# EAGLE design shoulder (EAGLE 7.6.0)
VERSION: 3
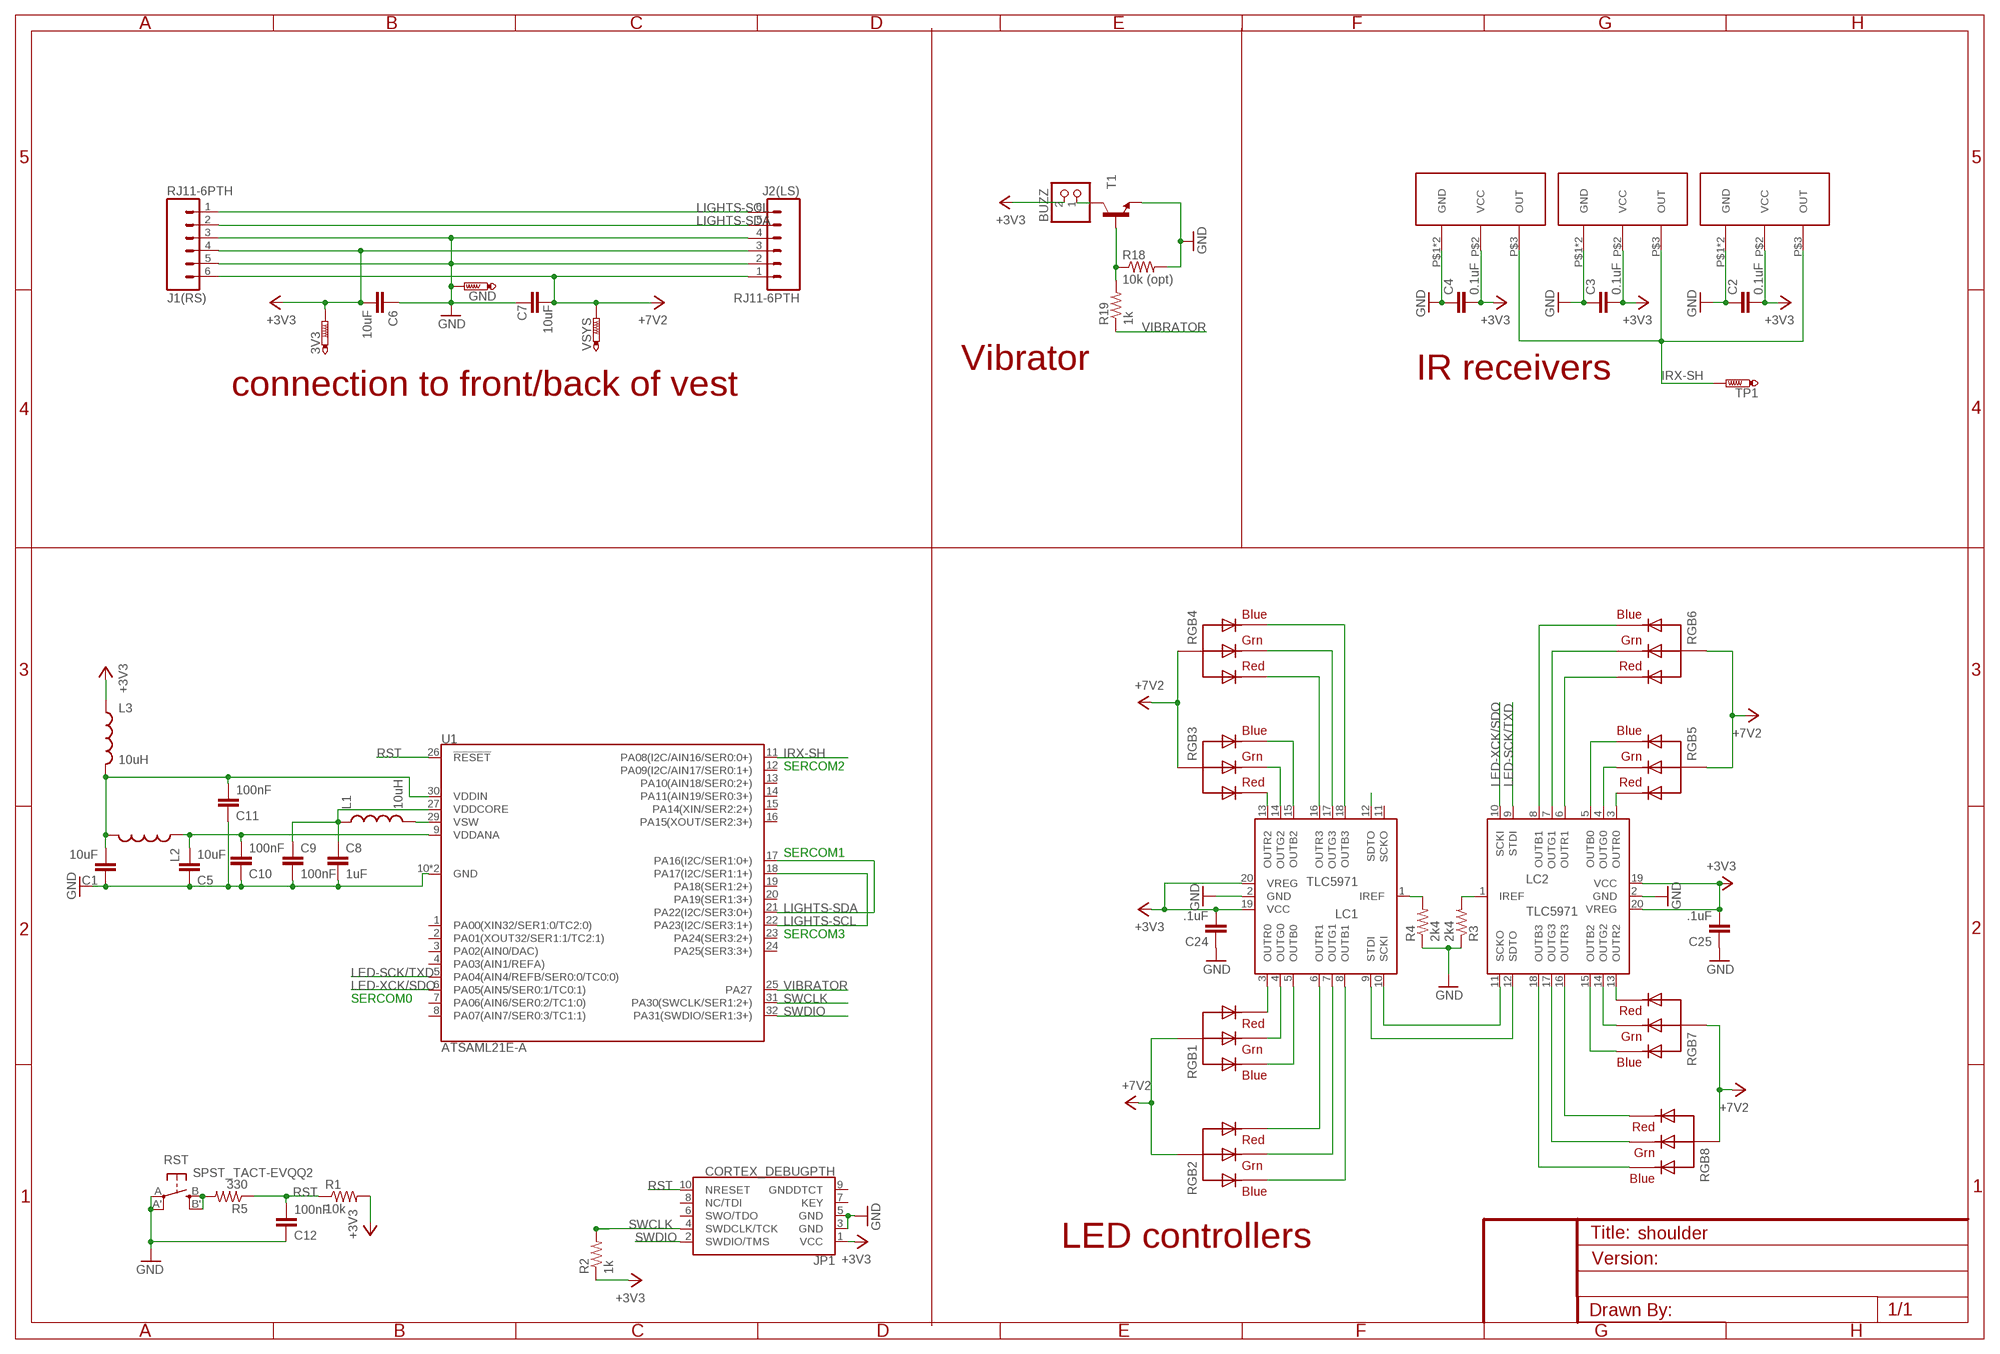
[diagram p0: schematic, sheet 1]

## Parts
3V3  PTR1PAD1-17  [P1-17]
BUZZ  JST_2PIN-THM  [JST-PH-2-THM]
C1  10uF  CAP0603-CAP  [0603-CAP]
C2  0.1uF  CAP0603-CAP  [0603-CAP]
C3  0.1uF  CAP0603-CAP  [0603-CAP]
C4  0.1uF  CAP0603-CAP  [0603-CAP]
C5  10uF  CAP0603-CAP  [0603-CAP]
C6  10uF  CAP1206  [1206]
C7  10uF  CAP1206  [1206]
C8  1uF  CAP0603-CAP  [0603-CAP]
C9  100nF  CAP0603-CAP  [0603-CAP]
C10  100nF  CAP0603-CAP  [0603-CAP]
C11  100nF  CAP0603-CAP  [0603-CAP]
C12  100nF  CAP0603-CAP  [0603-CAP]
C24  .1uF  CAP0603-CAP  [0603-CAP]
C25  .1uF  CAP0603-CAP  [0603-CAP]
GND  PTR1PAD1-17  [P1-17]
J1(RS)  RJ11-6PTH  [RJ11-6]
J2(LS)  RJ11-6PTH  [RJ11-6]
JP1  CORTEX_DEBUGPTH  [2X5-PTH-1.27MM]
L1  10uH  INDUCTOR0805  [0805]
L2  INDUCTOR0603  [0603]
L3  10uH  INDUCTOR0805  [0805]
LC1  TLC5971  [SSOP20]
LC2  TLC5971  [SSOP20]
R1  10k  RESISTOR0603-RES  [0603-RES]
R2  1k  RESISTOR0603-RES  [0603-RES]
R3  2k4  RESISTOR0603-RES  [0603-RES]
R4  2k4  RESISTOR0603-RES  [0603-RES]
R5  330  RESISTOR0603-RES  [0603-RES]
R18  10k (opt)  RESISTOR0603-RES  [0603-RES]
R19  1k  RESISTOR0603-RES  [0603-RES]
RGB1  AVAGO-RGB-SMT  [AVAGO-SMT-RGB]
RGB2  AVAGO-RGB-SMT  [AVAGO-SMT-RGB]
RGB3  AVAGO-RGB-SMT  [AVAGO-SMT-RGB]
RGB4  AVAGO-RGB-SMT  [AVAGO-SMT-RGB]
RGB5  AVAGO-RGB-SMT  [AVAGO-SMT-RGB]
RGB6  AVAGO-RGB-SMT  [AVAGO-SMT-RGB]
RGB7  AVAGO-RGB-SMT  [AVAGO-SMT-RGB]
RGB8  AVAGO-RGB-SMT  [AVAGO-SMT-RGB]
RST  SPST_TACT-EVQQ2  [EVQ-Q2]
T1  TRANSISTOR_NPNSOT23  [SOT23]
TP1  PTR1PAD1-17  [P1-17]
U1  ATSAML21E-A  [TQFP-32-7X7-0.8MM]
U$1  TSMP77000SIDE  [TSMP77000]
U$2  TSMP77000SIDE  [TSMP77000]
U$3  TSMP77000UP  [HEIMDALL-UP]
VSYS  PTR1PAD1-17  [P1-17]

## Nets
+3V3: 3V3.TP BUZZ.2 C2.2 C3.2 C4.2 C6.2 C24.2 C25.2 J1(RS).4 J2(LS).3 JP1.1(VCC) L3.1 LC1.19(VCC) LC1.20(VREG) LC2.19(VCC) LC2.20(VREG) R1.2 R2.1 U$1.P$2(VCC) U$2.P$2(VCC) U$3.P$2(VCC)
+7V2: C7.2 J1(RS).6 J2(LS).1 RGB1.P$4(VCC) RGB1.P$5(VCC) RGB1.P$6(VCC) RGB2.P$4(VCC) RGB2.P$5(VCC) RGB2.P$6(VCC) RGB3.P$4(VCC) RGB3.P$5(VCC) RGB3.P$6(VCC) RGB4.P$4(VCC) RGB4.P$5(VCC) RGB4.P$6(VCC) RGB5.P$4(VCC) RGB5.P$5(VCC) RGB5.P$6(VCC) RGB6.P$4(VCC) RGB6.P$5(VCC) RGB6.P$6(VCC) RGB7.P$4(VCC) RGB7.P$5(VCC) RGB7.P$6(VCC) RGB8.P$4(VCC) RGB8.P$5(VCC) RGB8.P$6(VCC) VSYS.TP
GND: C1.1 C2.1 C3.1 C4.1 C5.1 C6.1 C7.1 C8.2 C9.2 C10.1 C11.1 C12.1 C24.1 C25.1 GND.TP J1(RS).3 J1(RS).5 J2(LS).2 J2(LS).4 JP1.3(GND) JP1.5(GND) LC1.2(GND) LC2.2(GND) R3.1 R4.1 R18.2 RST.A'(P1) RST.A(P) T1.2(E) U1.10(GND) U1.28(GND) U$1.P$1(GND) U$1.P$4(GND) U$2.P$1(GND) U$2.P$4(GND) U$3.P$1(GND) U$3.P$4(GND)
IRX-SH: TP1.TP U1.11(PA08(I2C/AIN16/SER0:0+)) U$1.P$3(OUT) U$2.P$3(OUT) U$3.P$3(OUT)
LED-SCK/TXD: LC2.9(STDI) U1.5(PA04(AIN4/REFB/SER0:0/TC0:0))
LED-XCK/SDO: LC2.10(SCKI) U1.6(PA05(AIN5/SER0:1/TC0:1))
LIGHTS-SCL: J1(RS).1 J2(LS).6 U1.18(PA17(I2C/SER1:1+)) U1.22(PA23(I2C/SER3:1+))
LIGHTS-SDA: J1(RS).2 J2(LS).5 U1.17(PA16(I2C/SER1:0+)) U1.21(PA22(I2C/SER3:0+))
N$1: LC1.10(SCKI) LC2.11(SCKO)
N$2: LC1.9(STDI) LC2.12(SDTO)
N$3: LC1.12(SDTO)
N$4: C5.2 C10.2 L2.1 U1.9(VDDANA)
N$5: C1.2 C11.2 L2.2 L3.2 U1.30(VDDIN)
N$6: R5.2 RST.B'(S1) RST.B(S)
N$7: L1.2 U1.29(VSW)
N$8: LC1.3(OUTR0) RGB1.P$3(RED)
N$10: LC2.3(OUTR0) RGB5.P$3(RED)
N$11: LC2.6(OUTR1) RGB6.P$3(RED)
N$12: C8.1 C9.1 L1.1 U1.27(VDDCORE)
N$14: BUZZ.1 T1.3(C)
N$17: LC1.15(OUTB2) RGB3.P$1(BLUE)
N$19: R18.1 R19.2 T1.1(B)
N$24: LC1.13(OUTR2) RGB3.P$3(RED)
N$27: LC1.14(OUTG2) RGB3.P$2(GREEN)
N$31: LC1.16(OUTR3) RGB4.P$3(RED)
N$32: LC1.17(OUTG3) RGB4.P$2(GREEN)
N$33: LC1.18(OUTB3) RGB4.P$1(BLUE)
N$36: LC1.4(OUTG0) RGB1.P$2(GREEN)
N$37: LC1.5(OUTB0) RGB1.P$1(BLUE)
N$38: LC1.6(OUTR1) RGB2.P$3(RED)
N$39: LC1.7(OUTG1) RGB2.P$2(GREEN)
N$40: LC1.8(OUTB1) RGB2.P$1(BLUE)
N$42: LC2.4(OUTG0) RGB5.P$2(GREEN)
N$43: LC2.5(OUTB0) RGB5.P$1(BLUE)
N$49: LC2.7(OUTG1) RGB6.P$2(GREEN)
N$50: LC2.8(OUTB1) RGB6.P$1(BLUE)
N$51: LC2.16(OUTR3) RGB8.P$3(RED)
N$52: LC2.17(OUTG3) RGB8.P$2(GREEN)
N$53: LC2.18(OUTB3) RGB8.P$1(BLUE)
N$54: LC2.15(OUTB2) RGB7.P$1(BLUE)
N$55: LC2.14(OUTG2) RGB7.P$2(GREEN)
N$56: LC2.13(OUTR2) RGB7.P$3(RED)
N$61: LC1.1(IREF) R4.2
N$62: LC2.1(IREF) R3.2
RST: C12.2 JP1.10(NRESET) R1.1 R5.1 U1.26(!RESET!)
SWCLK: JP1.4(SWDCLK/TCK) R2.2 U1.31(PA30(SWCLK/SER1:2+))
SWDIO: JP1.2(SWDIO/TMS) U1.32(PA31(SWDIO/SER1:3+))
VIBRATOR: R19.1 U1.25(PA27)
Unconnected: JP1.6(SWO/TDO) JP1.7(KEY) JP1.8(NC/TDI) JP1.9(GNDDTCT) LC1.11(SCKO) U1.1(PA00(XIN32/SER1:0/TC2:0)) U1.2(PA01(XOUT32/SER1:1/TC2:1)) U1.3(PA02(AIN0/DAC)) U1.4(PA03(AIN1/REFA)) U1.7(PA06(AIN6/SER0:2/TC1:0)) U1.8(PA07(AIN7/SER0:3/TC1:1)) U1.12(PA09(I2C/AIN17/SER0:1+)) U1.13(PA10(AIN18/SER0:2+)) U1.14(PA11(AIN19/SER0:3+)) U1.15(PA14(XIN/SER2:2+)) U1.16(PA15(XOUT/SER2:3+)) U1.19(PA18(SER1:2+)) U1.20(PA19(SER1:3+)) U1.23(PA24(SER3:2+)) U1.24(PA25(SER3:3+))

## Notes on the sheet
- Vibrator | IR receivers
- connection to front/back of vest
- SERCOM2
- SERCOM1
- SERCOM3
- SERCOM0
- LED controllers

## Library data of the parts
3V3 GND TP1 VSYS = testpad:PTR1: TEST PIN
BUZZ = adafruit:JST_2PIN: JST 2-Pin Connectors of various flavors SMT-RA (S2B-PH-SM4) 4UConnector #17311 SMT (B2B-PH-SM4) THM-RA (S2B-PH) THM (B2B-PH)
C1 C5-C12 = SparkFun-Passives:CAP: Capacitor Standard 0603 ceramic capacitor, and 0.1" leaded capacitor.
C2-C4 C24 C25 = SparkFun-Capacitors:CAP: Capacitor Standard 0603 ceramic capacitor, and 0.1" leaded capacitor.
J1(RS) J2(LS) = SparkFun-Connectors:RJ11-6: RJ11 Jack Simple 6 pin RJ11 jack. Commonly found on CAT3 devices and Microchip programmers. SKU: PRT-00132
JP1 = greg:CORTEX_DEBUG: Cortex Debug Connector Datasheet <http://infocenter.arm.com/help/topic/com.arm.doc.faqs/attached/13634/cortex_debug_connectors.pdf>
L1-L3 = SparkFun-Passives:INDUCTOR: Inductors Basic Inductor/Choke - 0603 and 1206. Footprints are not proven and vary greatly between part numbers. INDUCTOR POWER 3.3UH 4.0A SMD 0.197" L x 0.197" W x 0.177" H (5.00mm x 5.00mm x 4.50mm)
LC1 LC2 = greg:TLC5971
R1-R5 R18 R19 = SparkFun-Resistors:RESISTOR: Resistor Basic schematic elements and footprints for 0603, 1206, and PTH resistors.
RGB1-RGB8 = greg:AVAGO-RGB-SMT
RST = adafruit:SPST_TACT: SMT 6mm switch, EVQQ2 series http://www.ladyada.net/library/eagle
T1 = SparkFun-DiscreteSemi:TRANSISTOR_NPN: Generic NPN BJT. MMBT2222 is the common NPN we use. Double check against datasheet- not all devices are the same!
U1 = greg:ATSAML21E: Atmel SAML21E SMART ARM-Based Microcontroller The Atmel ® | SMART ™ SAM L21 is a series of low-power microcontrollers using the 32-bit ARM ® Cortex ® -M0+ processor, and ranging from 32- to 64-pins with up to 256KB Flash and 32KB of SRAM. The SAM L21 devices operate at a maximum frequency of 48MHz and reach 2.46 CoreMark/MHz. They are designed for simple and intuitive migration with identical peripheral modules, hex compatible code, identical linear address map and pin compatible migration paths between all devices in the product series. All devices include intelligent and flexible peripherals, Atmel Event System for inter-peripheral signaling, and support for capacitive touch button, slider and wheel user interfaces.
U$1-U$3 = greg:TSMP77000

## Board
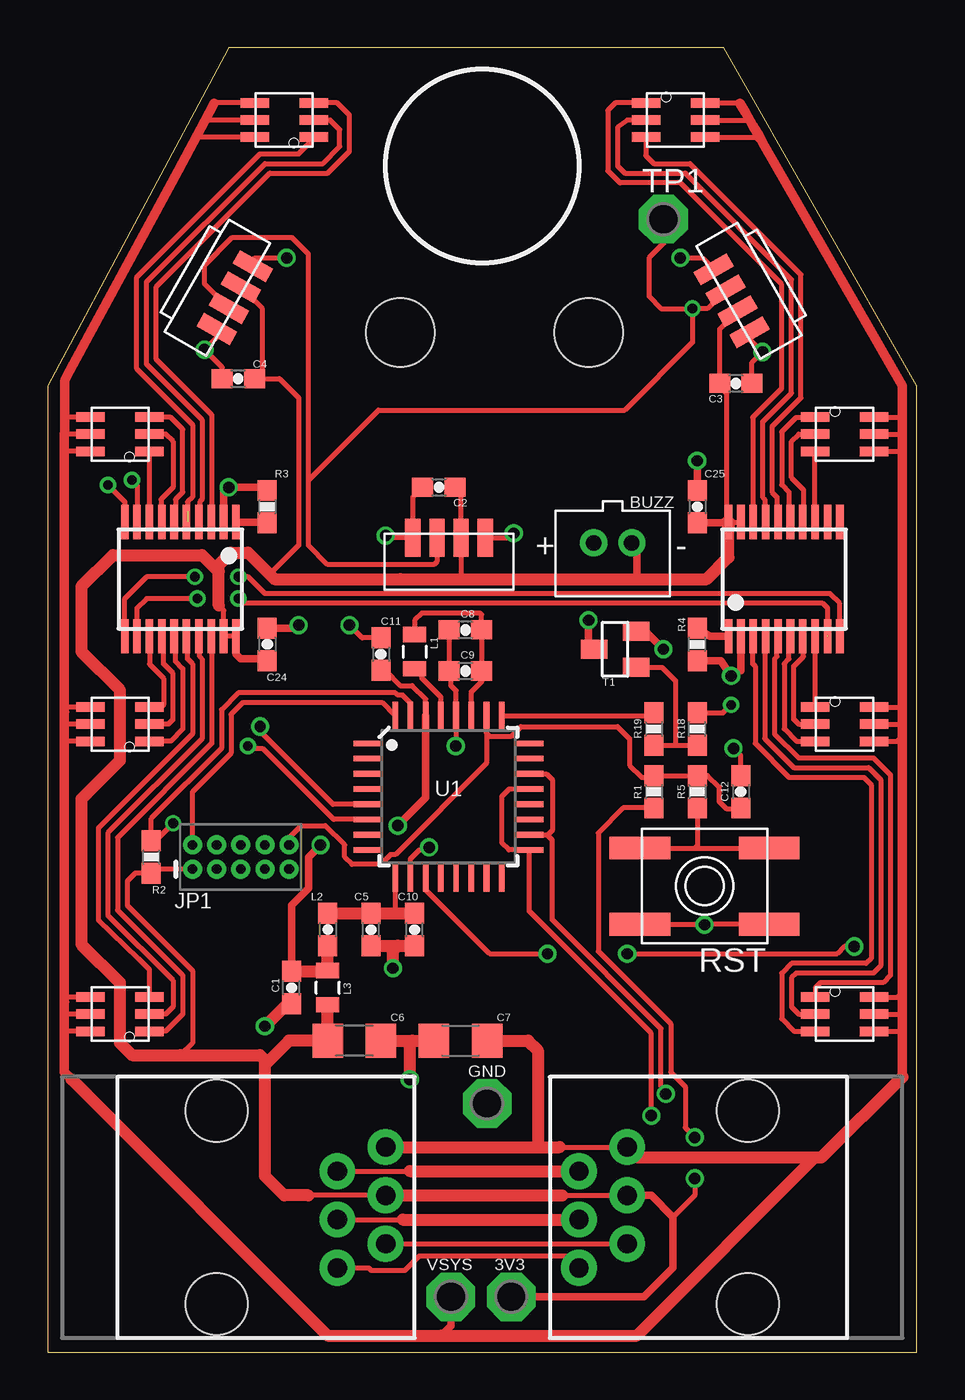
[diagram p1: board, top side]
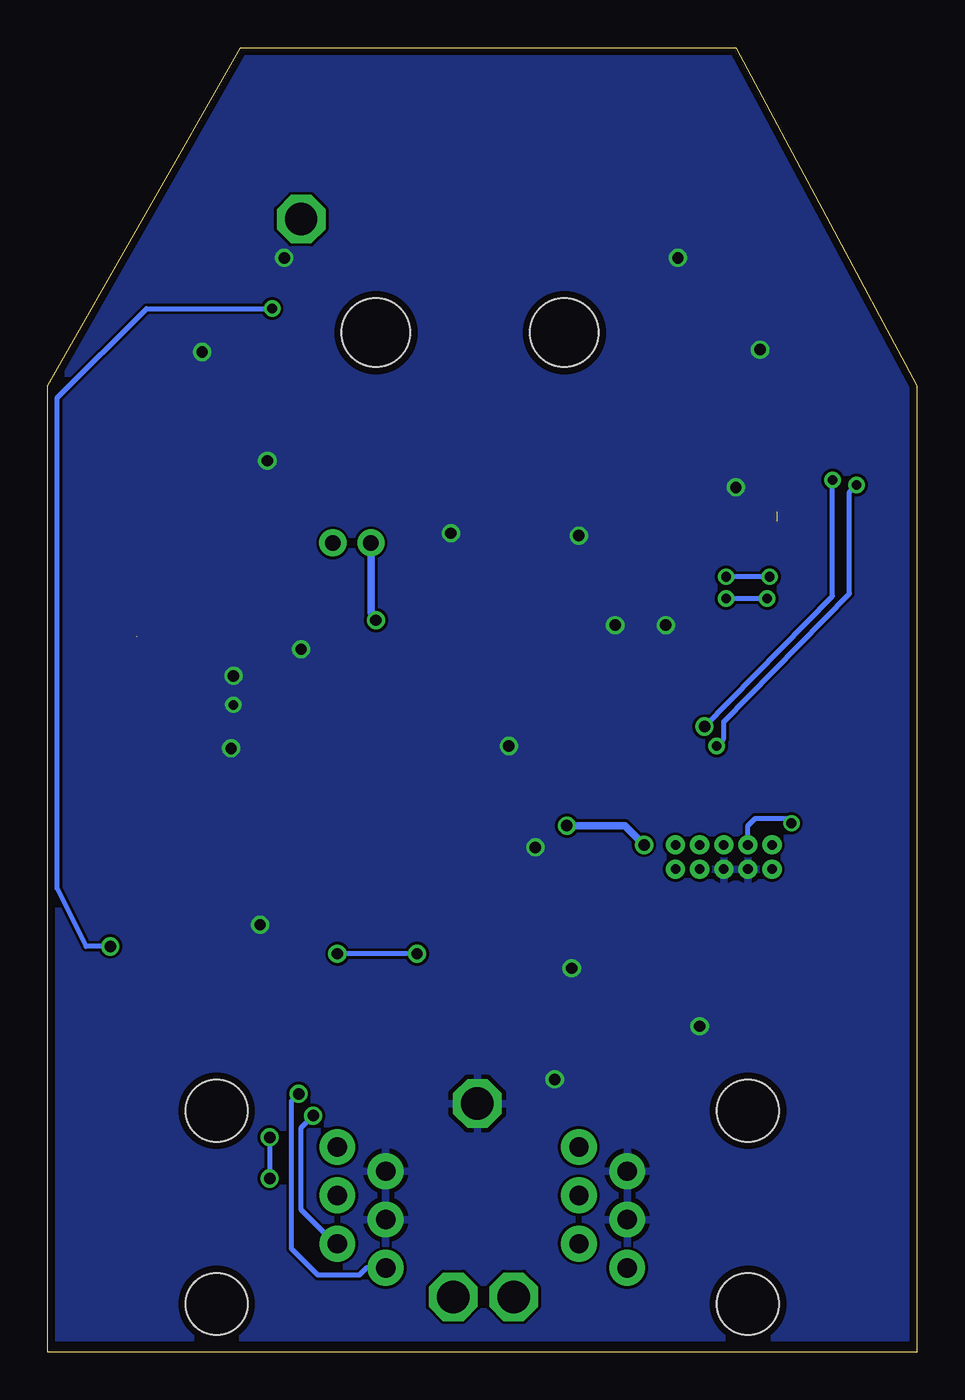
[diagram p2: board, bottom side, seen from below]

Size 45.72 x 68.58 mm. Coordinates in mm from the lower left corner, seen from the top.
Outline: 0,0 45.72,0 45.72,50.8 35.56,68.58 9.53,68.58 0,50.8 0,0
Copper layers (1*16): Top 0.0356mm / dielectric 1.5011mm / Bottom 0.0356mm
Design rules "default": minimum track width 6mil, minimum drill 13mil, track to track 6mil, track to pad 6mil, pad to pad 6mil, via to via 6mil, smd to smd 6mil, copper to edge 15mil, drill to drill 6mil, minimum pad ring 7mil, minimum via ring 7mil, stop-mask expansion 4mil, vias tented up to drill 0mil, thermal gap 10mil
Holes 3.61 mm at 18.54,53.59 28.45,53.59

### Footprints (pad centres in the part's own frame; a part is rotated, then mirrored left to right if it is on the bottom)
P1-17 = drill 1.702 pad 2.54 octagon: TP 0,0
JST-PH-2-THM = drill 0.8 pad 1.422: 1 1,0; 2 -1,0
0603-CAP = smd 1.1 x 1: 1 -0.85,0; 2 0.85,0
1206 = smd 1.6 x 1.8: 1 -1.4,0; 2 1.4,0
RJ11-6 = drill 1.016 pad 1.88: 1 1.905,8.89; 2 3.175,6.35; 3 4.445,8.89; 4 5.715,6.35; 5 6.985,8.89; 6 8.255,6.35 | hole 3.251: 0,0; 10.16,0
2X5-PTH-1.27MM = drill 0.508 pad 1: 1 -2.54,-0.635; 2 -2.54,0.635; 3 -1.27,-0.635; 4 -1.27,0.635; 5 0,-0.635; 6 0,0.635; 7 1.27,-0.635; 8 1.27,0.635; 9 2.54,-0.635; 10 2.54,0.635
0805 = smd 0.8 x 1.2: 1 -0.9,0; 2 0.9,0
0603 = smd 1.1 x 1: 1 -0.85,0; 2 0.85,0
SSOP20 = smd 0.4 x 1.8: 1 -2.925,-3; 2 -2.275,-3; 3 -1.625,-3; 4 -0.975,-3; 5 -0.325,-3; 6 0.325,-3; 7 0.975,-3; 8 1.625,-3; 9 2.275,-3; 10 2.925,-3; 11 2.925,3; 12 2.275,3; 13 1.625,3; 14 0.975,3; 15 0.325,3; 16 -0.325,3; 17 -0.975,3; 18 -1.625,3; 19 -2.275,3; 20 -2.925,3
0603-RES = smd 1.1 x 1: 1 -0.85,0; 2 0.85,0
AVAGO-SMT-RGB = smd 0.5 x 1.5: P$1 -0.9,-1.55; P$2 0,-1.55; P$3 0.9,-1.55; P$4 -0.9,1.55; P$5 0,1.55; P$6 0.9,1.55
EVQ-Q2 = smd 3.2 x 1.2: A -3.4,-2; A' 3.4,-2; B -3.4,2; B' 3.4,2
SOT23 = smd 1 x 1.4: 1 -0.95,-1.1; 2 0.95,-1.1; 3 0,1.1
TQFP-32-7X7-0.8MM = smd 1.5 x 0.3: 1 -4.25,2.8; 2 -4.25,2; 3 -4.25,1.2; 5 -4.25,-0.4; 6 -4.25,-1.2; 7 -4.25,-2; 8 -4.25,-2.8; 17 4.25,-2.8; 18 4.25,-2; 19 4.25,-1.2; 20 4.25,-0.4; 22 4.25,1.2; 23 4.25,2; 24 4.25,2.8 | smd 1.5 x 0.28: 4 -4.25,0.4; 21 4.25,0.4 | smd 0.3 x 1.5: 9 -2.8,-4.25; 14 1.2,-4.25; 15 2,-4.25; 16 2.8,-4.25; 25 2.8,4.25; 26 2,4.25; 27 1.2,4.25; 28 0.4,4.25; 29 -0.4,4.25; 30 -1.2,4.25; 31 -2,4.25; 32 -2.8,4.25 | smd 0.28 x 1.5: 10 -2,-4.25; 11 -1.2,-4.25; 12 -0.4,-4.25; 13 0.4,-4.25
TSMP77000 = smd 0.8 x 2: P$1 2,1; P$2 0.73,1; P$3 -0.54,1; P$4 -1.81,1
HEIMDALL-UP = smd 0.8 x 2: P$1 -1.81,-0.27; P$2 -0.54,-0.27; P$3 0.73,-0.27; P$4 2,-0.27

### Placement (x,y rotation side)
3V3  24.38,2.92 0 top
BUZZ  29.72,42.55 180 top
C1  12.83,19.18 90 top
C2  20.57,45.47 0 top
C3  36.2,50.93 180 top
C4  10.03,51.18 0 top
C5  17.02,22.23 90 top
C6  16.13,16.38 180 top
C7  21.72,16.38 0 top
C8  21.97,37.97 180 top
C9  21.97,35.81 180 top
C10  19.3,22.23 90 top
C11  17.53,36.7 270 top
C12  36.45,29.46 270 top
C24  11.56,37.21 270 top
C25  34.16,44.45 270 top
GND  23.11,13.08 0 top
J1(RS)  36.83,2.54 90 top
J2(LS)  8.89,12.7 270 top
JP1  10.16,26.04 0 top
L1  19.3,36.83 270 top
L2  14.73,22.23 270 top
L3  14.73,19.18 90 top
LC1  38.73,40.64 0 top
LC2  6.99,40.64 180 top
R1  31.88,29.46 270 top
R2  5.46,26.04 90 top
R3  11.56,44.45 270 top
R4  34.16,37.21 90 top
R5  34.16,29.46 270 top
R18  34.16,32.77 90 top
R19  31.88,32.77 270 top
RGB1  41.91,17.78 270 top
RGB2  41.91,33.02 270 top
RGB3  41.91,48.26 270 top
RGB4  33.02,64.77 270 top
RGB5  12.45,64.77 90 top
RGB6  3.81,48.26 90 top
RGB7  3.81,33.02 90 top
RGB8  3.81,17.78 90 top
RST  34.54,24.51 0 top
T1  29.84,36.96 90 top
TP1  32.38,59.56 0 top
U1  21.08,29.21 0 top
U$1  10.67,54.86 60.3 top
U$2  35.05,54.86 299.7 top
U$3  21.21,42.55 180 top
VSYS  21.21,2.92 0 top

### Tracks (layer width: path | path; a pad name or v marks a point on that pad's centre or on a via)
+3V3  (via drill 0.6)
  Top 0.254: 27.05,8.26 J1(RS).4 | J2(LS).3 13.72,8.26 | LC2.20 LC2.19 9.26,39 9.01,39.25 | LC1.20 LC1.19 | U$1.P$2 11.3,54.85 11.3,51.56 10.92,51.18 C4.2 12.19,51.18 13.21,50.16 13.21,42.42 11.68,40.89 | U$2.P$2 35.34,53.79 C3.2 35.34,50.76 35.69,50.42 35.69,43.85 35.43,43.6 | 21.72,40.64 21.75,40.67 U$3.P$2 21.75,45.14 C2.2 | JP1.1 5.68,25.4 R2.1 4.61,25.18 4.19,24.77 4.19,23.5 7.62,20.07 7.62,16.26 6.99,15.62 | R1.2 30.27,28.61 28.96,27.3 28.96,21.08 32.77,17.27 32.77,14.73 33.53,13.97 33.53,11.81 v34.04,11.3 | v34.04,9.14 34.04,8.26 32.89,7.11
  Top 0.406: 18.53,40.66 18.54,40.64 | C24.2 11.21,36.45 10.16,36.45 9.91,36.7 LC2.20 | C25.2 35.43,43.6 36.02,43.6 LC1.20 | BUZZ.2 30.99,42.18 30.99,40.64 | 3V3.TP 31.37,2.92 32.89,4.45 32.89,7.11 31.75,8.26 J1(RS).4
  Top 0.635: J2(LS).3 27.05,8.26 | 13.72,8.26 12.45,8.26 11.43,9.27 11.43,15.11 | 11.43,15.11 11.43,15.37 11.18,15.62 6.99,15.62 4.45,15.62 3.81,16.26 3.81,19.43 1.78,21.46 1.78,29.08 3.81,31.11 3.81,34.8 1.78,36.83 1.78,40.26 3.43,41.91 8.13,41.91 9.01,41.03 | 9.01,39.25 9.01,41.03 | 9.01,41.03 9.01,41.39 9.65,42.04 10.54,42.04 11.68,40.89 11.94,40.64 18.54,40.64 21.72,40.64 30.99,40.64 34.67,40.64 35.81,41.78 35.81,43.39 LC1.20 | 11.43,15.11 12.7,16.38 C6.2 L3.1
  Bottom 0.254: v34.04,11.3 v34.04,9.14
+7V2
  Top 0.254: 1.02,33.66 0.89,33.53 | 1.02,18.41 0.89,18.54 | 44.83,18.41 44.96,18.29 | 26.92,10.79 J1(RS).6 | RGB7.P$4 2.25,32.13 0.89,32.13 | 2.16,33.02 RGB7.P$5 0.89,33.02 | RGB8.P$6 0.9,18.68 0.89,18.67 | RGB3.P$6 44.95,47.36 44.96,47.37 | RGB2.P$6 44.69,32.12 44.96,32.38 | RGB1.P$6 44.82,16.88 44.96,17.02 | 0.89,48.13 1.02,48.26 RGB6.P$5 | RGB3.P$4 44.95,49.16 44.96,49.15 | RGB3.P$5 44.96,48.26 | 37.38,63.87 37.42,63.91 | RGB8.P$5 0.89,17.78 | RGB8.P$4 1,16.88 0.89,16.76 | RGB1.P$4 44.72,18.68 44.96,18.92 | RGB1.P$5 44.83,17.78 44.96,17.65 | RGB2.P$4 44.82,33.92 44.96,33.78 | RGB2.P$5 44.83,33.02 44.96,32.89 | RGB7.P$6 2.25,33.91 0.89,33.91 | RGB5.P$5 8.19,64.77 8.26,64.71 | RGB5.P$6 8.65,65.67 8.76,65.66 | RGB5.P$4 7.83,63.87 7.86,63.97 | RGB4.P$6 37.26,63.87 37.7,63.43 | RGB4.P$5 36.8,64.77 37.09,64.48 | RGB4.P$4 36.29,65.67 36.56,65.4 | RGB6.P$6 0.91,49.16 0.9,49.15 | RGB6.P$4 1.03,47.36 0.89,47.5
  Top 0.406: VSYS.TP 21.21,1.4 20.7,0.89
  Top 0.508: 1.27,14.35 0.89,14.73 0.89,16.76 0.89,17.78 0.89,18.54 0.89,18.67 0.89,32.13 0.89,33.02 0.89,33.53 0.89,33.91 0.89,47.5 0.89,48.13 0.89,48.26 0.9,48.4 0.9,49.15 0.9,51.06 1.02,51.31 6.86,62.1 7.86,63.97 8.26,64.71 8.76,65.66 | 44.45,13.97 44.96,14.48 44.96,17.02 44.96,17.65 44.96,18.29 44.96,18.92 44.96,32.38 44.96,32.89 44.96,33.78 44.96,47.37 44.96,48.26 44.96,49.15 44.96,50.8 37.7,63.43 37.42,63.91 37.09,64.48 36.69,65.18 36.56,65.4 36.4,65.65
  Top 0.635: 1.27,14.35 14.73,0.89 20.7,0.89 30.99,0.89 40.35,10.25 | 44.96,14.48 40.68,10.25 40.35,10.25 | J2(LS).1 25.78,10.79 | 25.78,10.79 26.92,10.79 | J1(RS).6 31.02,10.25 40.35,10.25 | C7.2 25.27,16.38 25.78,15.88 25.78,10.79
GND  (via drill 0.5, 0.6)
  Top 0.254: J2(LS).2 19.05,9.53 | J2(LS).4 18.67,6.99 | U$1.P$1 10.47,57.1 10.9,57.53 v12.57,57.53 | C4.1 9.18,51.78 v8.26,52.7 8.9,53.35 U$1.P$4 | C3.1 37.05,52.03 v37.59,52.58 36.91,53.26 U$2.P$1 | v33.27,57.53 34.42,57.53 U$2.P$4 | C2.1 19.21,44.95 U$3.P$4 17.89,42.81 v17.78,42.93 | U$3.P$1 24.27,42.81 v24.51,43.05 | R18.2 35.52,33.62 v35.94,34.04 | RST.A 34.51,22.51 v34.54,22.48 34.58,22.51 RST.A' | C8.2 C9.2 21.21,35.73 21.21,35.05 21.48,34.78 U1.28 21.48,31.9 v21.46,31.88 | C12.1 36.45,31.37 v36.07,31.75 | C11.1 16.55,37.55 v15.88,38.23 | U1.10 19.08,25.94 19.56,26.42 19.94,26.42 v20.07,26.54
  Top 0.406: LC1.2 36.46,35.83 v35.94,35.56 35.39,36.36 R4.1 | C24.1 13.04,38.06 v13.21,38.23 | C25.1 v34.16,46.86 | LC2.2 9.26,45.2 v9.53,45.47 11.39,45.47 R3.1 | T1.2 31.43,37.91 v32.38,36.96
  Top 0.635: 19.05,9.53 J1(RS).5 | 18.67,6.99 J1(RS).3 | C6.1 19.18,16.38 | 19.18,16.38 C7.1 | v19.05,14.35 19.05,16.26 19.18,16.38 | C1.1 12.61,18.33 v11.43,17.14 | C5.1 18.41,21.38 | 18.41,21.38 C10.1 | v18.16,20.19 18.16,21.12 18.41,21.38
  pour Bottom: 0,50.8 9.02,68.58 35.69,68.58 45.72,50.8 45.97,0.76 0.25,0.76
IRX-SH  (via drill 0.51, 0.6)
  Top 0.254: U$1.P$3 8.26,56.17 8.26,57.15 9.72,58.61 12.83,58.61 13.72,57.72 13.72,45.85 | U$2.P$3 34.69,54.86 v33.91,54.86 | v33.91,54.86 33.91,53.09 30.35,49.53 17.4,49.53 13.72,45.85 | U$3.P$3 20.48,41.56 20.32,41.4 14.73,41.4 13.72,42.42 13.72,45.85 | TP1.TP 32.38,58.29 31.62,57.53 31.62,55.5 32.26,54.86 v33.91,54.86 | v42.42,21.34 41.91,21.34 41.53,20.95 v30.48,20.95 | U1.11 19.88,24.31 23.24,20.95 v26.29,20.95
  Bottom 0.254: v42.42,21.34 43.69,21.34 45.21,24.38 45.21,50.16 40.51,54.86 v33.91,54.86 | v26.29,20.95 v30.48,20.95
LED-SCK/TXD  (via drill 0.51, 0.6)
  Top 0.254: v4.45,45.85 4.71,45.58 LC2.9 | v11.18,32.89 11.18,32.64 15.01,28.81 U1.5
  Bottom 0.254: v11.18,32.89 4.45,39.75 v4.45,45.85
LED-XCK/SDO  (via drill 0.51)
  Top 0.254: v3.17,45.59 4.06,44.71 LC2.10 | v10.54,31.88 10.67,31.75 11.3,31.75 15.04,28.01 U1.6
  Bottom 0.254: v10.54,31.88 10.16,32.26 10.16,33.15 3.56,39.88 3.56,45.21 v3.17,45.59
LIGHTS-SCL  (via drill 0.6)
  Top 0.254: J2(LS).6 16.89,4.45 17.02,4.32 18.8,4.32 19.56,5.08 27.3,5.08 J1(RS).1 | U1.22 26.23,30.41 26.54,30.1 26.54,27.43 26.29,27.18 | 26.29,27.18 25.36,27.18 U1.18 | v32.51,13.59 32.51,13.72 32.26,13.97 32.26,17.02 26.54,22.73 26.54,26.92 26.29,27.18
  Bottom 0.254: J1(RS).1 28.96,4.45 29.34,4.06 31.5,4.06 32.89,5.46 32.89,13.21 v32.51,13.59
LIGHTS-SDA  (via drill 0.6)
  Top 0.254: J2(LS).5 J1(RS).2 | v31.75,12.45 31.75,16.76 25.33,23.18 U1.17 24.26,26.41 23.88,26.8 23.88,29.21 24.28,29.61 U1.21
  Bottom 0.254: J1(RS).2 30.61,5.71 32.38,7.49 32.38,11.81 v31.75,12.45
N$1  (via drill 0.51)
  Top 0.254: v7.75,40.77 5.21,40.77 4.06,39.62 LC2.11 | LC1.10 41.66,39.37 41.15,39.88 11.43,39.88 10.54,40.77 v10.03,40.77
  Bottom 0.254: v7.75,40.77 v10.03,40.77
N$2  (via drill 0.51)  (1 unrouted)
  Top 0.254: v7.87,39.62 5.21,39.62 4.71,39.13 LC2.12 | 41.02,37.65 41.02,39.12 40.77,39.37 10.29,39.37 v10.03,39.62
  Bottom 0.254: v7.87,39.62 v10.03,39.62
N$4
  Top 0.254: U1.9 18.28,23.2 18.16,23.07
  Top 0.635: L2.1 C5.2 18.16,23.07 C10.2
N$5  (via drill 0.6)
  Top 0.254: C11.2 17.74,35.85 18.54,35.05 19.18,35.05 19.88,34.35 U1.30
  Top 0.406: U1.30 19.88,29.15 v18.41,27.69 | v14.35,26.67 13.72,26.04 13.72,24.38 12.83,23.5 C1.2
  Top 0.635: C1.2 14.68,20.03 L3.2 L2.2
  Bottom 0.406: v18.41,27.69 15.37,27.69 v14.35,26.67
N$6
  Top 0.254: RST.B 34.04,26.51 | 34.04,26.51 RST.B' | R5.2 34.16,26.64 34.04,26.51
N$7
  Top 0.254: U1.29 20.68,34.44 19.68,35.43 19.68,35.55 L1.2
N$8
  Top 0.254: RGB1.P$3 40.35,16.89 39.24,16.89 38.61,17.53 38.61,19.94 39.12,20.45 43.05,20.45 43.31,20.7 43.31,29.84 42.93,30.23 38.99,30.23 37.21,32 37.21,36.07 37.08,36.2 37.08,37.61 LC1.3
N$10
  Top 0.254: LC2.3 8.64,43.67 8.64,49.28 5.71,52.2 5.71,56.01 11.68,61.98 14.73,61.98 15.88,63.12 15.88,65.02 15.23,65.67 RGB5.P$3
N$11
  Top 0.254: RGB6.P$3 5.37,49.15 6.48,49.15 7.11,48.51 7.11,45.21 6.73,44.83 6.73,43.71 LC2.6
N$12
  Top 0.254: U1.27 22.28,34.73 22.86,35.31 22.86,35.77 C9.1 C8.1 22.82,38.77 22.73,38.86 19.68,38.86 19.3,38.48 L1.1
N$14  (via drill 0.6)
  Top 0.406: T1.3 28.45,37.25 v28.45,38.48
  Bottom 0.406: v28.45,38.48 28.72,38.88 BUZZ.1
N$17
  Top 0.254: RGB3.P$1 40.35,49.15 39.37,49.15 38.61,48.39 38.61,45.59 38.99,45.21 38.99,43.71 LC1.15
N$19
  Top 0.254: R19.2 33.02,31.92 | 33.02,31.92 R18.1 | T1.1 32.32,36.01 33.02,35.31 33.02,31.92
N$24
  Top 0.254: LC1.13 RGB3.P$3
N$27
  Top 0.254: RGB3.P$2 39.5,48.26 39.12,47.88 39.12,45.97 39.75,45.34 39.75,43.68 LC1.14
N$31
  Top 0.254: RGB4.P$3 31.46,63.88 31.46,62.9 31.88,62.48 33.78,62.48 39.62,56.64 39.62,50.16 38.1,48.64 38.1,45.21 38.35,44.96 38.35,43.7 LC1.16
N$32
  Top 0.254: RGB4.P$2 30.48,64.77 29.97,64.39 29.97,62.36 30.35,61.98 33.53,61.98 39.12,56.39 39.12,50.42 37.59,48.9 37.59,44.96 37.72,44.83 37.72,43.68 LC1.17
N$33
  Top 0.254: RGB4.P$1 29.86,65.67 29.46,65.28 29.46,62.1 30.1,61.47 33.27,61.47 38.61,56.13 38.61,50.67 37.08,49.15 37.08,43.67 LC1.18
N$36
  Top 0.254: RGB1.P$2 39.5,17.78 39.12,18.16 39.12,19.68 39.37,19.94 43.43,19.94 43.81,20.32 43.81,30.1 43.18,30.73 39.24,30.73 37.72,32.26 37.72,37.6 LC1.4
N$37
  Top 0.254: RGB1.P$1 40.39,18.71 40.39,19.18 40.64,19.43 43.94,19.43 44.32,19.81 44.32,30.35 43.43,31.24 39.5,31.24 38.23,32.51 38.23,36.45 38.35,36.58 38.35,37.58 LC1.5
N$38
  Top 0.254: RGB2.P$3 40.35,32.13 39.37,32.13 38.73,32.77 38.73,36.2 38.99,36.45 38.99,37.57 LC1.6
N$39
  Top 0.254: RGB2.P$2 39.5,33.02 39.24,33.27 39.24,36.07 39.75,36.58 39.75,37.6 LC1.7
N$40
  Top 0.254: LC1.8 RGB2.P$1
N$42
  Top 0.254: LC2.4 8,43.68 8,44.7 8.13,44.83 8.13,49.02 5.21,51.94 5.21,56.26 11.43,62.48 14.48,62.48 15.37,63.37 15.37,64.26 14.86,64.77 RGB5.P$2
N$43  (1 unrouted)
  Top 0.254: 7.37,43.7 LC2.5 | 7.37,44.2 7.37,44.7 7.62,44.96 7.62,48.77 4.7,51.69 4.7,56.52 11.18,62.99 13.21,62.99 14,63.78 RGB5.P$1
N$49
  Top 0.254: RGB6.P$2 6.22,48.26 6.6,47.88 6.6,45.47 5.97,44.83 5.97,43.68 LC2.7
N$50
  Top 0.254: LC2.8 RGB6.P$1
N$51
  Top 0.254: 5.33,18.71 RGB8.P$3 5.36,20.12 4.79,20.68 2.67,22.73 2.67,27.56 7.62,32.51 7.62,36.2 7.37,36.45 7.37,37.58 LC2.16
N$52
  Top 0.254: RGB8.P$2 6.22,17.78 6.6,18.16 6.6,19.56 3.17,22.99 3.17,27.3 8.13,32.26 8.13,36.45 8,36.58 8,37.6 LC2.17
N$53
  Top 0.254: RGB8.P$1 5.37,16.89 6.22,16.89 7.11,17.78 7.11,19.81 3.68,23.24 3.68,27.05 8.64,32 8.64,37.61 LC2.18
N$54
  Top 0.254: RGB7.P$1 5.37,32.13 6.48,32.13 7.11,32.77 7.11,35.94 6.73,36.32 6.73,37.57 LC2.15
N$55
  Top 0.254: RGB7.P$2 6.35,33.02 6.6,33.27 6.6,35.69 6.1,36.2 6.1,37.55 LC2.14
N$56
  Top 0.254: LC2.13 5.36,36.17 6.1,35.43 6.1,34.04 5.97,33.91 5.37,33.91 RGB7.P$3
N$61
  Top 0.406: LC1.1 34.84,37.64 R4.2
N$62
  Top 0.406: LC2.1 11.26,43.64 R3.2
RST
  Top 0.254: C12.2 36.41,28.57 35.69,28.57 35.31,28.96 35.31,29.72 34.71,30.31 R5.1 R1.1 31.79,30.23 31.24,30.23 30.61,30.86 30.61,32.26 29.97,32.89 24.89,32.89 24.38,32.38 23.24,32.38 23.08,32.54 | U1.26 23.08,32.54 | 23.08,32.54 23.08,30.96 18.29,26.16 18.03,26.16 17.53,25.65 16,25.65 15.62,26.04 15.62,26.67 14.61,27.69 13.34,27.69 12.7,27.05 JP1.10
SWCLK  (via drill 0.51)
  Top 0.254: U1.31 19.08,34.13 18.67,34.54 18.41,34.54 18.29,34.67 10.03,34.67 9.14,33.78 9.14,31.75 5.46,28.07 R2.2 5.68,26.89 v6.6,27.81
  Bottom 0.254: JP1.4 8.89,27.69 8.51,28.07 6.86,28.07 v6.6,27.81
SWDIO
  Top 0.254: JP1.2 7.62,29.46 9.65,31.5 9.65,33.53 10.29,34.16 17.58,34.16 U1.32
VIBRATOR
  Top 0.254: 31.84,33.66 R19.1 31.72,33.46 U1.25

### Text on the board
tDocu: rev 4 | BOWSER | *